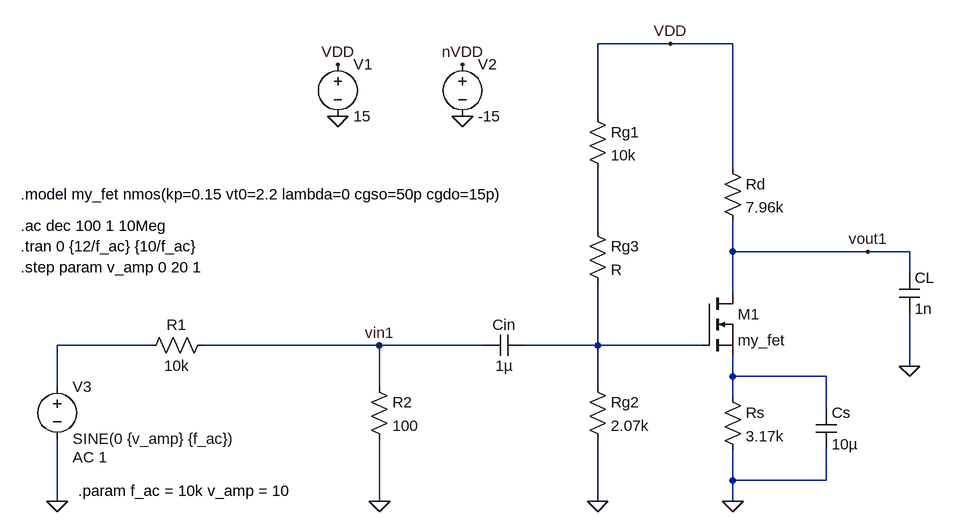
[diagram p0: schematic lab5.asc]
lab5.asc, the LTspice schematic file:
Version 4
SHEET 1 1208 680
WIRE 800 -384 688 -384
WIRE 896 -384 800 -384
WIRE 688 -272 688 -384
WIRE 896 -192 896 -384
WIRE 688 -96 688 -192
WIRE 896 -64 896 -112
WIRE 1104 -64 896 -64
WIRE 1168 -64 1104 -64
WIRE 1168 -32 1168 -64
WIRE 896 0 896 -64
WIRE 0 80 -144 80
WIRE 352 80 80 80
WIRE 512 80 352 80
WIRE 688 80 688 -16
WIRE 688 80 576 80
WIRE 848 80 688 80
WIRE 1168 112 1168 32
WIRE 896 128 896 96
WIRE 1040 128 896 128
WIRE -144 144 -144 80
WIRE 352 144 352 80
WIRE 688 144 688 80
WIRE 896 160 896 128
WIRE 1040 176 1040 128
WIRE 896 288 896 240
WIRE 1040 288 1040 240
WIRE 1040 288 896 288
WIRE -144 320 -144 224
WIRE 352 320 352 224
WIRE 688 320 688 224
WIRE 896 320 896 288
FLAG 288 -352 VDD
FLAG 480 -352 nVDD
FLAG 288 -272 0
FLAG 480 -272 0
FLAG -144 320 0
FLAG 352 320 0
FLAG 352 80 vin1
FLAG 688 320 0
FLAG 896 320 0
FLAG 800 -384 VDD
FLAG 1168 112 0
FLAG 1104 -64 vout1
SYMBOL voltage 288 -368 R0
WINDOW 123 0 0 Left 0
WINDOW 39 0 0 Left 0
SYMATTR InstName V1
SYMATTR Value 15
SYMBOL voltage 480 -368 R0
WINDOW 123 0 0 Left 0
WINDOW 39 0 0 Left 0
SYMATTR InstName V2
SYMATTR Value -15
SYMBOL voltage -144 128 R0
WINDOW 123 24 124 Left 2
WINDOW 39 0 0 Left 0
SYMATTR InstName V3
SYMATTR Value SINE(0 {v_amp} {f_ac})
SYMATTR Value2 AC 1
SYMBOL res 96 64 R90
WINDOW 0 0 56 VBottom 2
WINDOW 3 32 56 VTop 2
SYMATTR InstName R1
SYMATTR Value 10k
SYMBOL res 336 128 R0
SYMATTR InstName R2
SYMATTR Value 100
SYMBOL cap 576 64 R90
WINDOW 0 0 32 VBottom 2
WINDOW 3 32 32 VTop 2
SYMATTR InstName Cin
SYMATTR Value 1µ
SYMBOL res 672 128 R0
SYMATTR InstName Rg2
SYMATTR Value 2.07k
SYMBOL res 672 -112 R0
SYMATTR InstName Rg3
SYMBOL res 672 -288 R0
SYMATTR InstName Rg1
SYMATTR Value 10k
SYMBOL nmos 848 0 R0
SYMATTR InstName M1
SYMATTR Value my_fet
SYMBOL res 880 -208 R0
SYMATTR InstName Rd
SYMATTR Value 7.96k
SYMBOL res 880 144 R0
SYMATTR InstName Rs
SYMATTR Value 3.17k
SYMBOL cap 1024 176 R0
SYMATTR InstName Cs
SYMATTR Value 10µ
SYMBOL cap 1152 -32 R0
SYMATTR InstName CL
SYMATTR Value 1n
TEXT -200 -152 Left 2 !.model my_fet nmos(kp=0.15 vt0=2.2 lambda=0 cgso=50p cgdo=15p)
TEXT -112 304 Left 2 !.param f_ac = 10k v_amp = 10
TEXT -200 -104 Left 2 !.ac dec 100 1 10Meg
TEXT -200 -72 Left 2 !.tran 0 {12/f_ac} {10/f_ac}
TEXT -200 -40 Left 2 !.step param v_amp 0 20 1

The netlist it stands for:
* lab5.asc
V1 VDD 0 15
V2 nVDD 0 -15
V3 N002 0 SINE(0 {v_amp} {f_ac}) AC 1
R1 vin1 N002 10k
R2 vin1 0 100
Cin N003 vin1 1µ
Rg2 N003 0 2.07k
Rg3 N001 N003 R
Rg1 VDD N001 10k
M1 vout1 N003 N004 N004 my_fet
Rd VDD vout1 7.96k
Rs N004 0 3.17k
Cs N004 0 10µ
CL vout1 0 1n
.model NMOS NMOS
.model PMOS PMOS
.lib standard.mos
.model my_fet nmos(kp=0.15 vt0=2.2 lambda=0 cgso=50p cgdo=15p)
.param f_ac = 10k v_amp = 10
.ac dec 100 1 10Meg
.tran 0 {12/f_ac} {10/f_ac}
.step param v_amp 0 20 1
.backanno
.end